# Altium schematic sheet Power Management.SchDoc (part 1 of 3)
size C
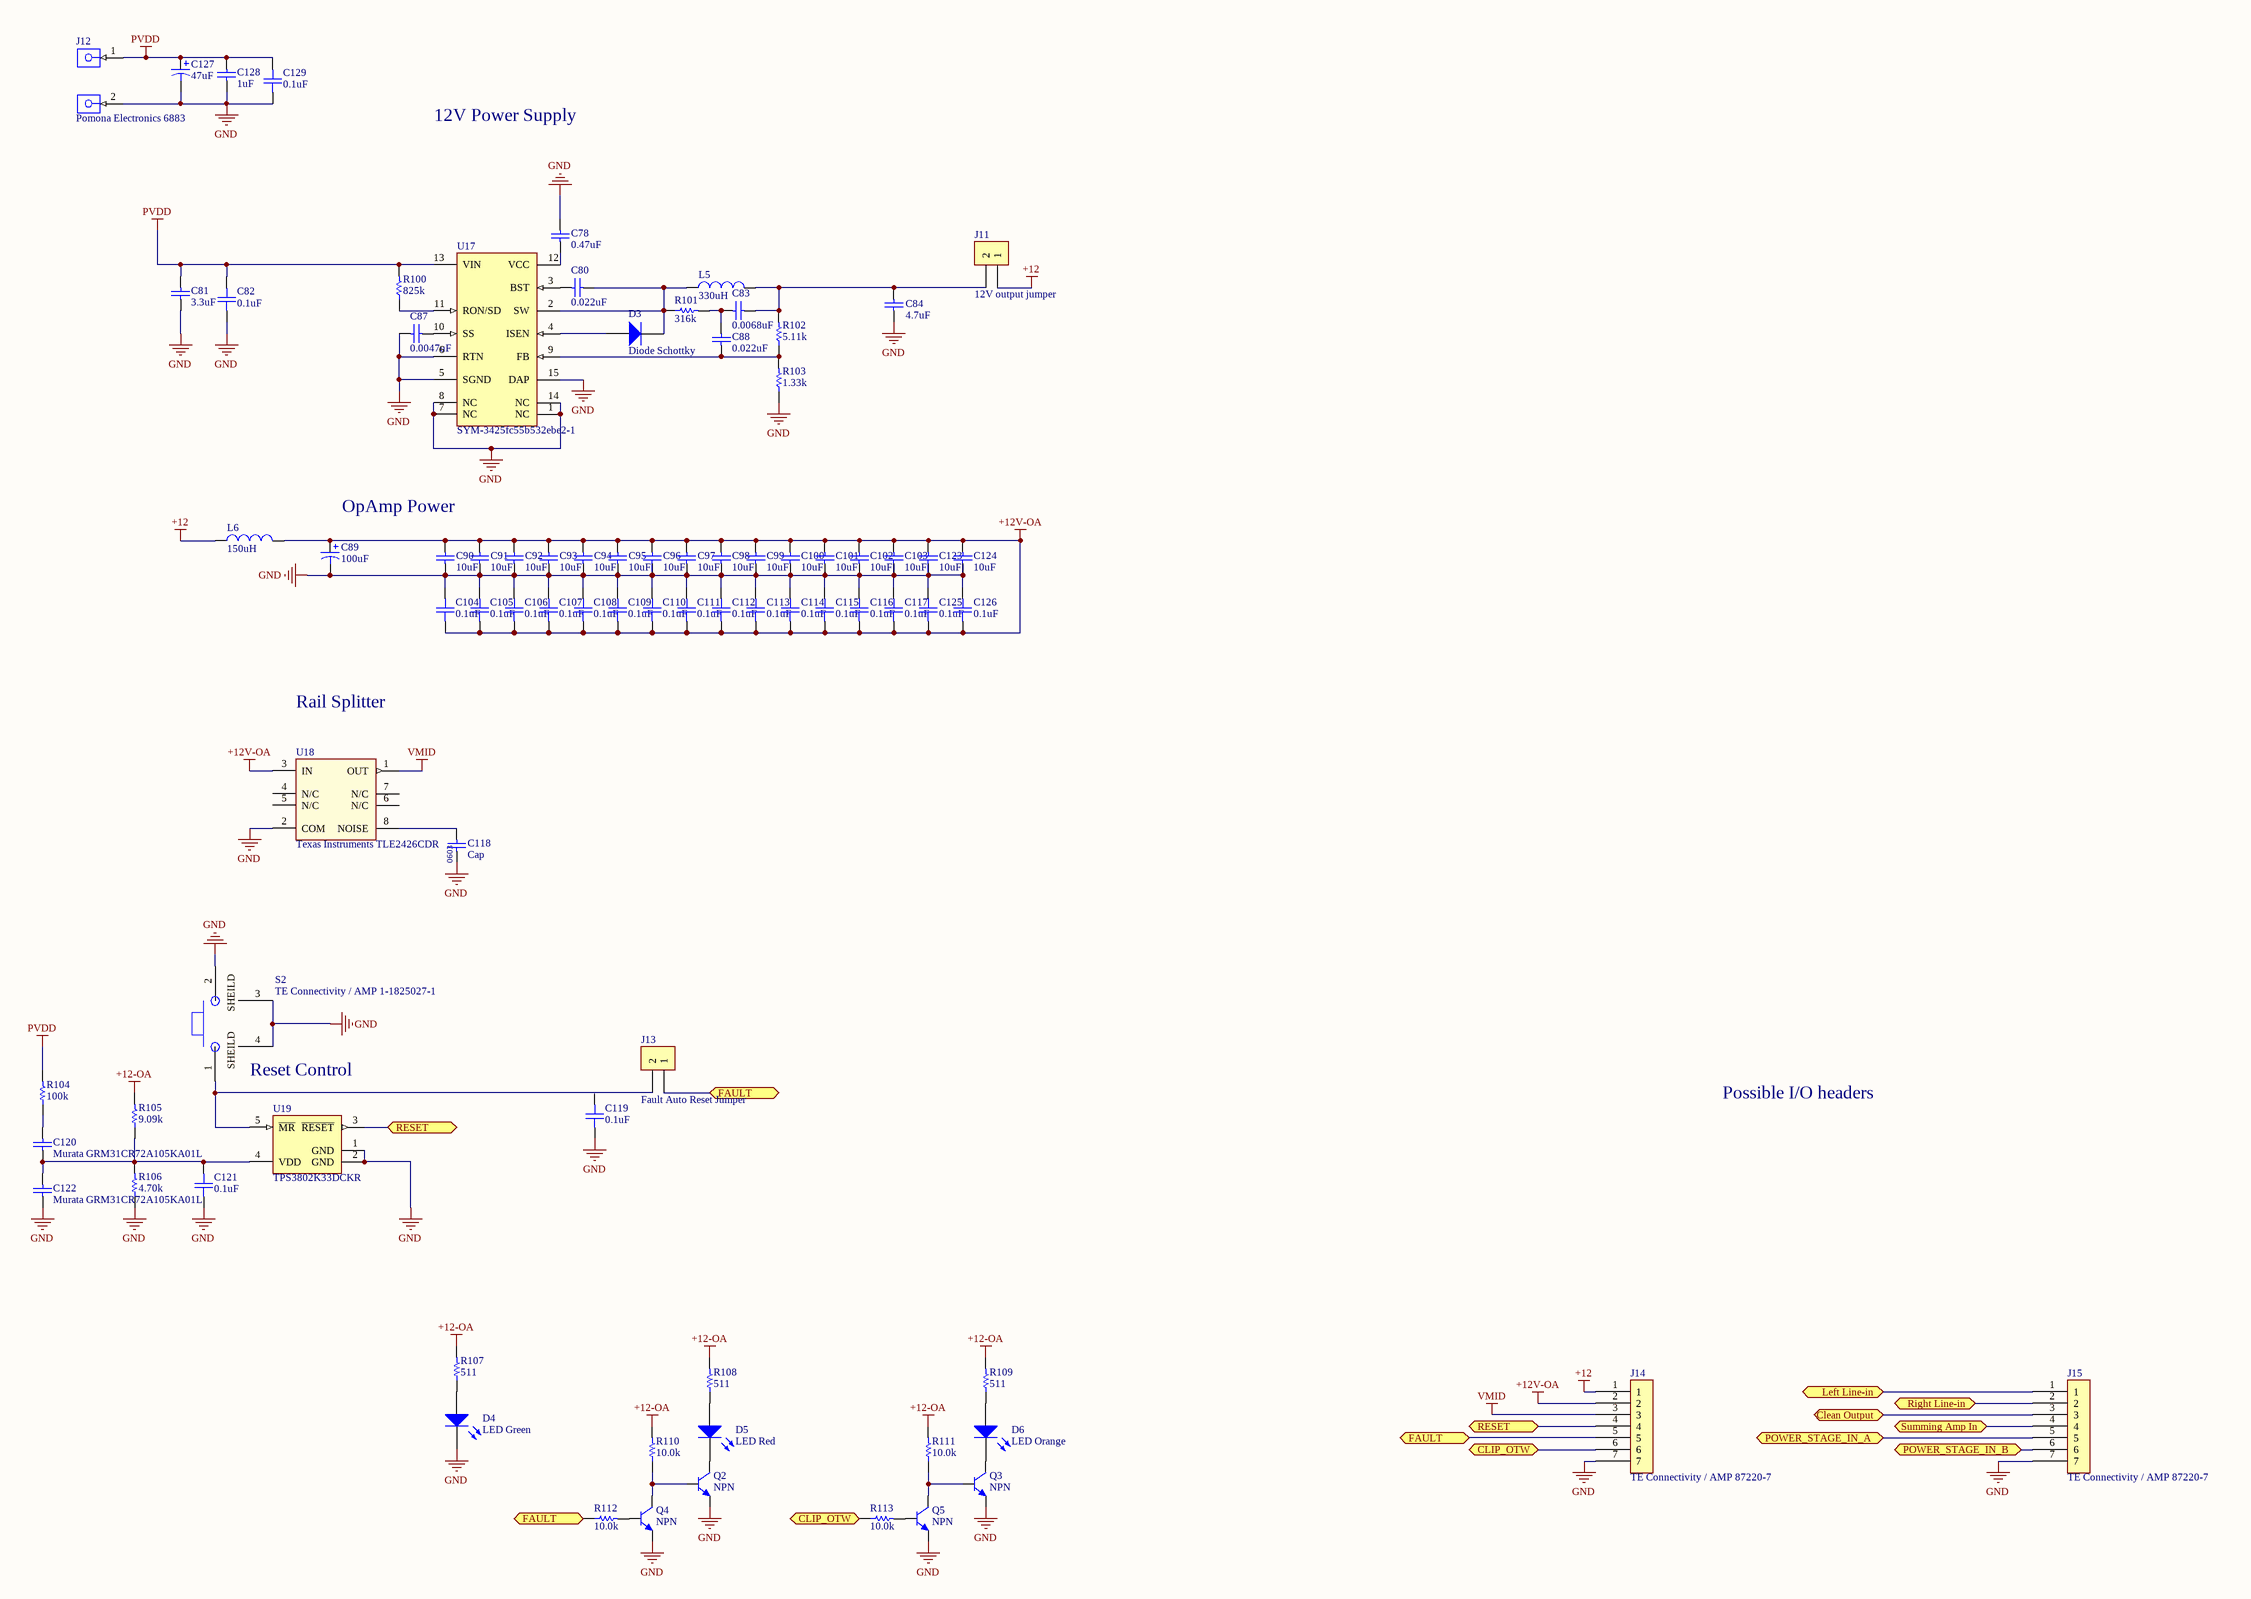
[diagram p0: Power Management.SchDoc]

## Parts
C78  0.47uF  [PCB-i0dme2so6deleduh8uuv-1]
C80  0.022uF  [CAPC1608X87X35NL15T15]
C81  3.3uF  [PCB-chn8p1js4k1ngrwxbp4y-1]
C82  0.1uF  [PCB-jzhgzaa3ohr19x5vw660-1]
C83  0.0068uF  [CAPC1608X06N]
C84  4.7uF  [CAPC2013X94X50LL20T25]
C87  0.0047uF  [CAPC2012X08M]
C88  0.022uF  [CAPC1608X87X35NL15T15]
C89  100uF  [PCB-in8pxjyymzgw21cvj8kw-1]
C90  10uF  [CAPC3216X94X50NL20T25]
C91  10uF  [CAPC3216X94X50NL20T25]
C92  10uF  [CAPC3216X94X50NL20T25]
C93  10uF  [CAPC3216X94X50NL20T25]
C94  10uF  [CAPC3216X94X50NL20T25]
C95  10uF  [CAPC3216X94X50NL20T25]
C96  10uF  [CAPC3216X94X50NL20T25]
C97  10uF  [CAPC3216X94X50NL20T25]
C98  10uF  [CAPC3216X94X50NL20T25]
C99  10uF  [CAPC3216X94X50NL20T25]
C100  10uF  [CAPC3216X94X50NL20T25]
C101  10uF  [CAPC3216X94X50NL20T25]
C102  10uF  [CAPC3216X94X50NL20T25]
C103  10uF  [CAPC3216X94X50NL20T25]
C104  0.1uF  [PCB-jzhgzaa3ohr19x5vw660-1]
C105  0.1uF  [PCB-jzhgzaa3ohr19x5vw660-1]
C106  0.1uF  [PCB-jzhgzaa3ohr19x5vw660-1]
C107  0.1uF  [PCB-jzhgzaa3ohr19x5vw660-1]
C108  0.1uF  [PCB-jzhgzaa3ohr19x5vw660-1]
C109  0.1uF  [PCB-jzhgzaa3ohr19x5vw660-1]
C110  0.1uF  [PCB-jzhgzaa3ohr19x5vw660-1]
C111  0.1uF  [PCB-jzhgzaa3ohr19x5vw660-1]
C112  0.1uF  [PCB-jzhgzaa3ohr19x5vw660-1]
C113  0.1uF  [PCB-jzhgzaa3ohr19x5vw660-1]
C114  0.1uF  [PCB-jzhgzaa3ohr19x5vw660-1]
C115  0.1uF  [PCB-jzhgzaa3ohr19x5vw660-1]
C116  0.1uF  [PCB-jzhgzaa3ohr19x5vw660-1]
C117  0.1uF  [PCB-jzhgzaa3ohr19x5vw660-1]
C118  Cap  [CAPC1608X07N]
C119  0.1uF  [PCB-jzhgzaa3ohr19x5vw660-1]
C120  Murata GRM31CR72A105KA01L  [CAPC3216X180X55NL20T25]
C121  0.1uF  [PCB-jzhgzaa3ohr19x5vw660-1]
C122  Murata GRM31CR72A105KA01L  [CAPC3216X180X55NL20T25]
C123  10uF  [CAPC3216X94X50NL20T25]
C124  10uF  [CAPC3216X94X50NL20T25]
C125  0.1uF  [PCB-jzhgzaa3ohr19x5vw660-1]
C126  0.1uF  [PCB-jzhgzaa3ohr19x5vw660-1]
C127  47uF  [PCBComponent_1]
C128  1uF  [CAPC3216X180X55NL20T25]
C129  0.1uF  [PCB-jzhgzaa3ohr19x5vw660-1]
D3  Diode Schottky  [PCB-iur9xjol2nuz7see6iaw-1]
D4  LED Green  [PCB - LS A67K]
D5  LED Red  [PCB - LS A67K]
D6  LED Orange  [PCB - LS A67K]
J11  12V output jumper  [PCB-atpiihg40e8c2nmcy2an-1]
J12  Pomona Electronics 6883  [PCB-19368571-1]
J13  Fault Auto Reset Jumper  [PCB-atpiihg40e8c2nmcy2an-1]
J14  TE Connectivity / AMP 87220-7  [PCB-2nimx3srux7q5lcqcrab-1]
J15  TE Connectivity / AMP 87220-7  [PCB-2nimx3srux7q5lcqcrab-1]
L5  330uH  [Coilcraft MSS1210]
L6  150uH  [PCB-lfrzme2idivti55vz3sm-1]
Q2  NPN  [PCB-zwf9crilb66v8jey4z70-1]
Q3  NPN  [PCB-zwf9crilb66v8jey4z70-1]
Q4  NPN  [PCB-zwf9crilb66v8jey4z70-1]
Q5  NPN  [PCB-zwf9crilb66v8jey4z70-1]
R100  825k  [RESC1609X55X28LL05T18]
R101  316k  [RESC1609X55X28LL05T18]
R102  5.11k  [PCB-dm6f2vlmfnf97yy2nsh5-1]
R103  1.33k  [RESC1609X55X28LL05T18]
R104  100k  [RESC1609X55X28LL05T18]
R105  9.09k  [RESC1609X55X28LL05T18]
R106  4.70k  [RESC1609X55X28LL05T18]
R107  511  [RESC1609X55X28LL05T18]
R108  511  [RESC1609X55X28LL05T18]
R109  511  [RESC1609X55X28LL05T18]
R110  10.0k  [RESC1609X55X28LL05T18]
R111  10.0k  [RESC1609X55X28LL05T18]
R112  10.0k  [RESC1609X55X28LL05T18]
R113  10.0k  [RESC1609X55X28LL05T18]
S2  TE Connectivity / AMP 1-1825027-1  [PCB-z0tn1x4l8qb5b43a6q2n-1]
U17  SYM-3425fc55b532ebe2-1  [PCB-d66e4jgxn3exdfjea6yc-1]
U18  Texas Instruments TLE2426CDR  [INF-PG-DSO-8-3_M]
U19  TPS3802K33DCKR  [DCK5_N]

## Ports
Clean Output, CLIP_OTW, FAULT, Left Line-in, POWER_STAGE_IN_A, POWER_STAGE_IN_B, RESET, Right Line-in, Summing Amp In

## Nets
+12: J11.1 J14.1 L6.1
+12-OA: R105.2 R107.2 R108.2 R109.2 R110.2 R111.2
+12V-OA: C89.1 C90.2 C91.2 C92.2 C93.2 C94.2 C95.2 C96.2 C97.2 C98.2 C99.2 C100.2 C101.2 C102.2 C103.2 C104.1 C105.1 C106.1 C107.1 C108.1 C109.1 C110.1 C111.1 C112.1 C113.1 C114.1 C115.1 C116.1 C117.1 C123.2 C124.2 C125.1 C126.1 J14.2 L6.2 U18.3(IN)
GND: C78.2 C81.1 C82.1 C84.1 C87.1 C89.2 C90.1 C91.1 C92.1 C93.1 C94.1 C95.1 C96.1 C97.1 C98.1 C99.1 C100.1 C101.1 C102.1 C103.1 C104.2 C105.2 C106.2 C107.2 C108.2 C109.2 C110.2 C111.2 C112.2 C113.2 C114.2 C115.2 C116.2 C117.2 C118.1 C119.1 C121.1 C122.1 C123.1 C124.1 C125.2 C126.2 C127.2 C128.1 C129.1 D4.2(K) J12.2(-) J14.7 J15.7 Q2.2(E) Q3.2(E) Q4.2(E) Q5.2(E) R103.1 R106.1 U17.1(NC) U17.5(SGND) U17.6(RTN) U17.7(NC) U17.8(NC) U17.14(NC) U17.15(DAP) U18.2(COM) U19.1(GND) U19.2(GND)
PVDD: C81.2 C82.2 C127.1 C128.2 C129.2 J12.1(+) R100.2 R104.2 U17.13(VIN)
VMID: J14.3 U18.1(OUT)
Clean Output: J15.3 ; port Clean Output
CLIP_OTW: J14.6 R113.1 ; port CLIP_OTW
FAULT: J13.1 J14.5 R112.1 ; port FAULT
Left Line-in: J15.1 ; port Left Line-in
POWER_STAGE_IN_A: J15.5 ; port POWER_STAGE_IN_A
POWER_STAGE_IN_B: J15.6 ; port POWER_STAGE_IN_B
RESET: J14.4 U19.3(~{RESET}) ; port RESET
Right Line-in: J15.2 ; port Right Line-in
Summing Amp In: J15.4 ; port Summing Amp In
NetC78_1: C78.1 U17.12(VCC)
NetC80_1: C80.1 U17.3(BST)
NetC80_2: C80.2 D3.2(K) L5.1 R101.1 U17.2(SW)
NetC83_1: C83.1 C88.2 R101.2
NetC83_2: C83.2 C84.2 J11.2 L5.2 R102.2
NetC87_2: C87.2 U17.10(SS)
NetC88_1: C88.1 R102.1 R103.2 U17.9(FB)
NetC118_2: C118.2 U18.8(NOISE)
NetC120_1: C120.1 C121.2 C122.2 R105.1 R106.2 U19.4(VDD)
NetC120_2: C120.2 R104.1
NetD3_1: D3.1(A) U17.4(ISEN)
NetD4_1: D4.1(A) R107.1
NetD5_1: D5.1(K) Q2.3(C)
NetD5_2: D5.2(A) R108.1
NetD6_1: D6.1(A) R109.1
NetD6_2: D6.2(K) Q3.3(C)
NetJ13_2: J13.2 U19.5(~{MR})
NetQ2_1: Q2.1(B) Q4.3(C) R110.1
NetQ3_1: Q3.1(B) Q5.3(C) R111.1
NetQ4_1: Q4.1(B) R112.2
NetQ5_1: Q5.1(B) R113.2
NetR100_1: R100.1 U17.11(RON/SD)

Not connected (* = marked no-connect by the designer): C119 2; S2 1 2 3 4; U18 4(N/C) 5(N/C) 6(N/C) 7(N/C)

## Notes on the sheet
- 12V Power Supply
- OpAmp Power
- Rail Splitter
- (near S2) Reset Control
- Possible I/O headers
- (in symbol CMP-4d86860896969241-7) SHEILD
- (in symbol CMP-463c8d25af8a99fb-1) 0603

## Library data of the parts
C78 = CMP-fe3b3644688f21fc-1: 1206 0.47 uF 100 V ±10% Tolerance X7R Multilayer Ceramic Chip Capacitor; Manufacturer Part Number: CC1206KKX7R0BB474; OctopartID: fe3b3644688f21fc; RoHS: Compliant; Octopart URL: https://octopart.com/cc1206kkx7r0bb474-yageo-24490962; Capacitance: 0.47 uF; Mounting Style: Surface Mount
C80 C88 = CMP-124409-3: CAP CER 0.022UF 100V X7R 0603; Manufacturer: Kemet; Manufacturer Part Number: C0603C223K1RACTU; Capacitance: 2.2e-08 F; Capacitance Tolerance: ±10%; Dielectric Material: Ceramic; Lead-Free Status: R; Voltage Rating (DC): 100.0 V; Case/Package: 0603; Dielectric Characteristic: X7R; Mounting Style: Surface Mount; Number of Pins: 2; Octopart Url: https://octopart.com/c0603c223k1ractu-kemet-150702; OctopartID: 7e94b79c175ca153; Packaging: Cut Tape (CT); REACH SVHC Compliance: No SVHC; RoHS: Compliant; Size-Height: 0.0008 m; Size-Length: 0.0016 m; Size-Width: 0.0008 m
C81 = CMP-d69b1be3b579095c-1: Cap Ceramic 3.3uF 100V X7R 10% Pad SMD 1812 125C Automotive T/R; Manufacturer Part Number: C1812C335K1RACAUTO
C82 C104-C117 C119 C121 C125 C126 C129 = CMP-120189-6: Capacitor 0.1 uF 100 Volt X7R 10% Surface Mount 0603 Paper Tape and Reel; Manufacturer Part Number: GRM188R72A104KA35D; Lead-Free Status: Lead Free; Voltage Rating (DC): 100V; Capacitance: 100n; Case/Package: 0603; Number of Pins: 2; Octopart URL: http://octopart.com/grm188r72a104ka35d-murata-196904; RoHS: Compliant; Dielectric Characteristic: X7R; Mounting Style: Surface Mount; OctopartID: f4783d71d0362bbf; Capacitance Tolerance: ±10%
C83 = CMP-2021ea3b622bffe6-1: Cap Ceramic 0.0068uF 100V C0G 5% Pad SMD 0603 125C T/R; RoHS: Compliant
C84 = CMP-120945-5: 0805 4.7 uF 25 V ±20% Tolerance X5R SMT Multilayer Ceramic Capacitor; Manufacturer: Murata; Manufacturer Part Number: GRM21BR61E475MA12L; Packaging: Cut Tape (CT); Size-Length: 2.00 mm; Capacitance Tolerance: ±20%; OctopartID: 948d5d4e8ecd4b4a
C87 = CMP-1cbed49aa786c379-1: Cap Ceramic 0.0047uF 100V X7R 10% SMD 0805 125°C Paper T/R